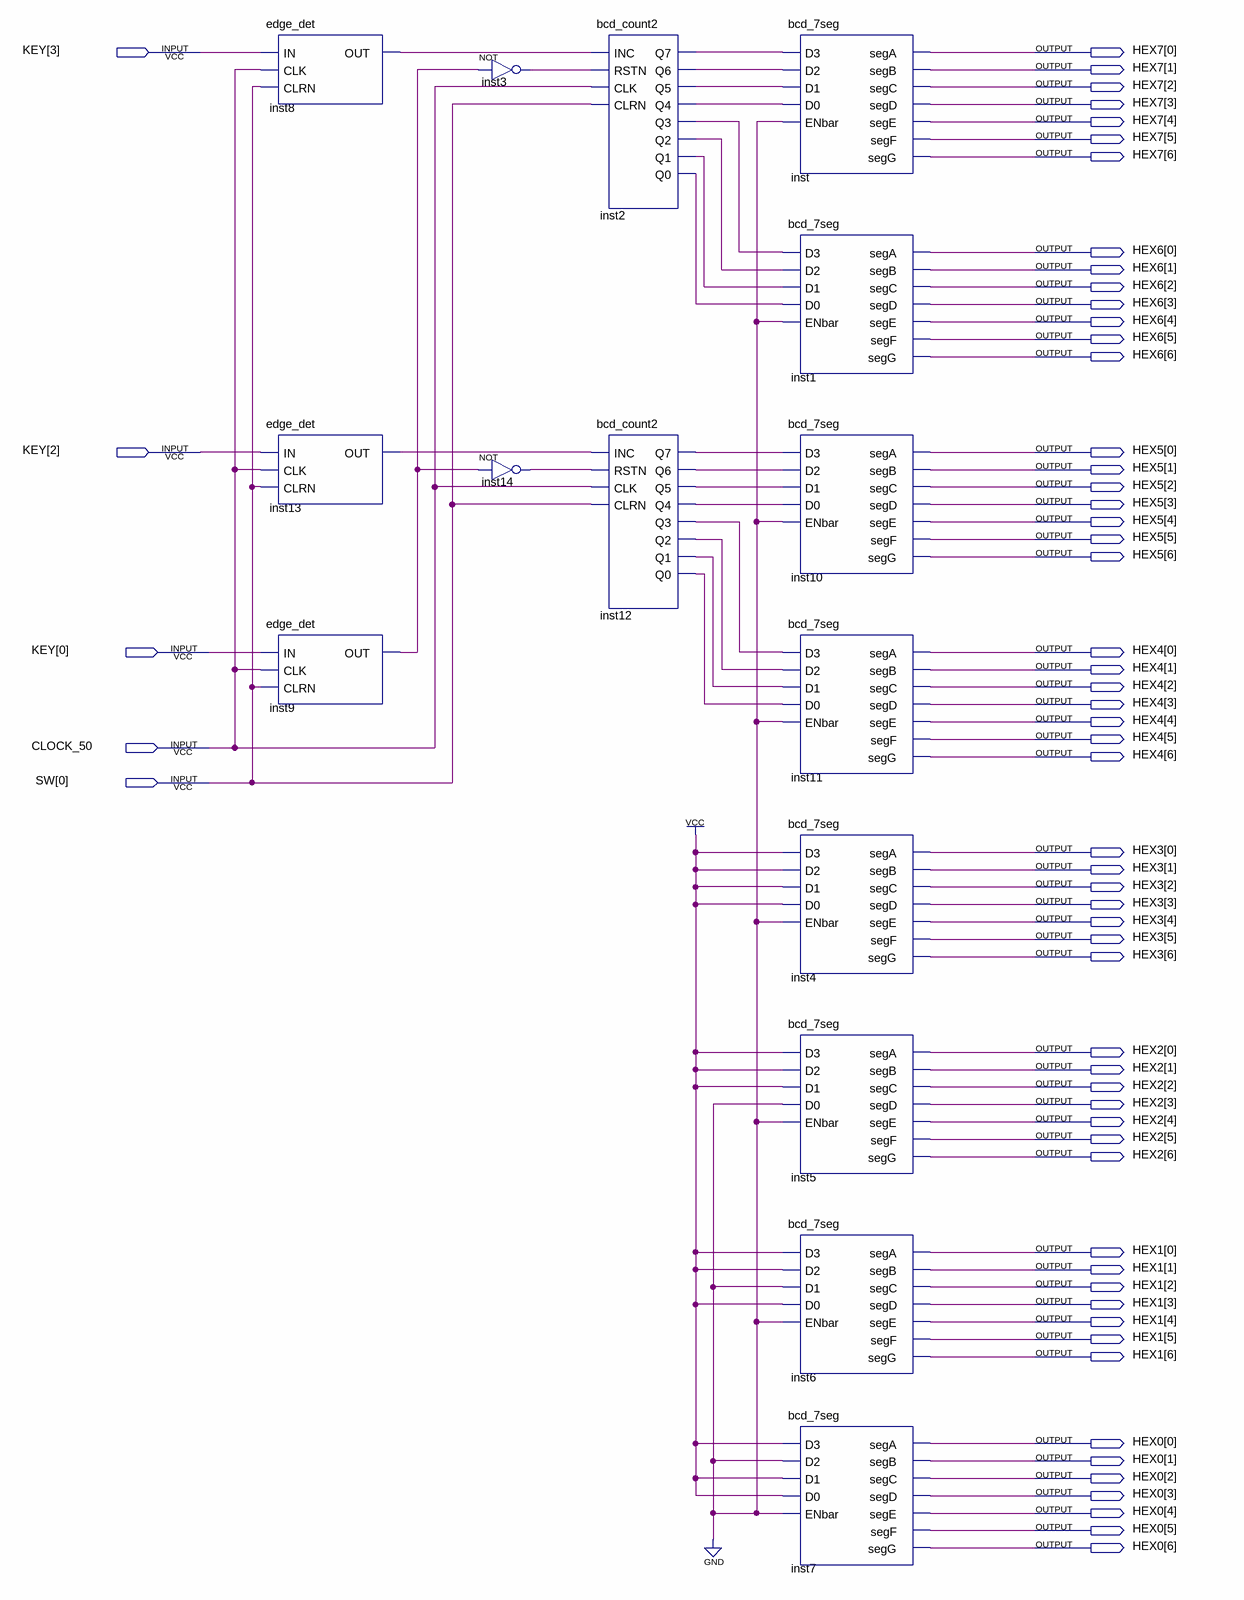
[diagram p0: schematic sheet]
// Quartus schematic Lab4_top_level.bdf as structural Verilog: 15 symbols, 61 pins
module Lab4_top_level (
  input  [3:0] KEY,
  input  CLOCK_50,
  input  [0:0] SW,
  output [6:0] HEX7,
  output [6:0] HEX6,
  output [6:0] HEX5,
  output [6:0] HEX4,
  output [6:0] HEX3,
  output [6:0] HEX2,
  output [6:0] HEX1,
  output [6:0] HEX0
);

  wire inst2_q0, inst2_q1, inst2_q2, inst2_q3, inst2_q4, inst2_q5, inst2_q6, inst2_q7, inst3_out, inst8_out,
       inst9_out, inst12_q0, inst12_q1, inst12_q2, inst12_q3, inst12_q4, inst12_q5, inst12_q6, inst12_q7,
       inst13_out, inst14_out;

  edge_det inst8 (.IN(KEY[3]), .CLK(CLOCK_50), .CLRN(SW[0]), .OUT(inst8_out));
  edge_det inst13 (.IN(KEY[2]), .CLK(CLOCK_50), .CLRN(SW[0]), .OUT(inst13_out));
  edge_det inst9 (.IN(KEY[0]), .CLK(CLOCK_50), .CLRN(SW[0]), .OUT(inst9_out));
  not inst3 (inst3_out, inst9_out);
  not inst14 (inst14_out, inst9_out);
  bcd_count2 inst2 (
    .INC(inst8_out), .RSTN(inst3_out), .CLK(CLOCK_50), .CLRN(SW[0]), .Q7(inst2_q7), .Q6(inst2_q6),
    .Q5(inst2_q5), .Q4(inst2_q4), .Q3(inst2_q3), .Q2(inst2_q2), .Q1(inst2_q1), .Q0(inst2_q0));
  bcd_count2 inst12 (
    .INC(inst13_out), .RSTN(inst14_out), .CLK(CLOCK_50), .CLRN(SW[0]), .Q7(inst12_q7), .Q6(inst12_q6),
    .Q5(inst12_q5), .Q4(inst12_q4), .Q3(inst12_q3), .Q2(inst12_q2), .Q1(inst12_q1), .Q0(inst12_q0));
  bcd_7seg inst (
    .D3(inst2_q7), .D2(inst2_q6), .D1(inst2_q5), .D0(inst2_q4), .ENbar(1'b0), .segA(HEX7[0]), .segB(HEX7[1]),
    .segC(HEX7[2]), .segD(HEX7[3]), .segE(HEX7[4]), .segF(HEX7[5]), .segG(HEX7[6]));
  bcd_7seg inst1 (
    .D3(inst2_q3), .D2(inst2_q2), .D1(inst2_q1), .D0(inst2_q0), .ENbar(1'b0), .segA(HEX6[0]), .segB(HEX6[1]),
    .segC(HEX6[2]), .segD(HEX6[3]), .segE(HEX6[4]), .segF(HEX6[5]), .segG(HEX6[6]));
  bcd_7seg inst10 (
    .D3(inst12_q7), .D2(inst12_q6), .D1(inst12_q5), .D0(inst12_q4), .ENbar(1'b0), .segA(HEX5[0]),
    .segB(HEX5[1]), .segC(HEX5[2]), .segD(HEX5[3]), .segE(HEX5[4]), .segF(HEX5[5]), .segG(HEX5[6]));
  bcd_7seg inst11 (
    .D3(inst12_q3), .D2(inst12_q2), .D1(inst12_q1), .D0(inst12_q0), .ENbar(1'b0), .segA(HEX4[0]),
    .segB(HEX4[1]), .segC(HEX4[2]), .segD(HEX4[3]), .segE(HEX4[4]), .segF(HEX4[5]), .segG(HEX4[6]));
  bcd_7seg inst4 (
    .D3(1'b1), .D2(1'b1), .D1(1'b1), .D0(1'b1), .ENbar(1'b0), .segA(HEX3[0]), .segB(HEX3[1]), .segC(HEX3[2]),
    .segD(HEX3[3]), .segE(HEX3[4]), .segF(HEX3[5]), .segG(HEX3[6]));
  bcd_7seg inst5 (
    .D3(1'b1), .D2(1'b1), .D1(1'b1), .D0(1'b0), .ENbar(1'b0), .segA(HEX2[0]), .segB(HEX2[1]), .segC(HEX2[2]),
    .segD(HEX2[3]), .segE(HEX2[4]), .segF(HEX2[5]), .segG(HEX2[6]));
  bcd_7seg inst6 (
    .D3(1'b1), .D2(1'b1), .D1(1'b0), .D0(1'b1), .ENbar(1'b0), .segA(HEX1[0]), .segB(HEX1[1]), .segC(HEX1[2]),
    .segD(HEX1[3]), .segE(HEX1[4]), .segF(HEX1[5]), .segG(HEX1[6]));
  bcd_7seg inst7 (
    .D3(1'b1), .D2(1'b0), .D1(1'b1), .D0(1'b1), .ENbar(1'b0), .segA(HEX0[0]), .segB(HEX0[1]), .segC(HEX0[2]),
    .segD(HEX0[3]), .segE(HEX0[4]), .segF(HEX0[5]), .segG(HEX0[6]));
endmodule
